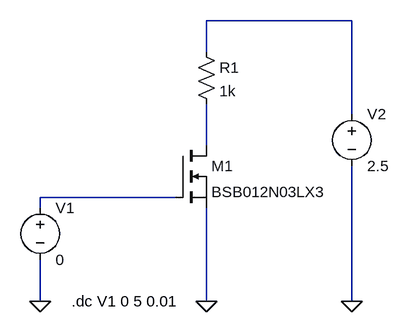
[diagram p0: schematic Draft3.asc]
Draft3.asc, the LTspice schematic file:
Version 4
SHEET 1 880 680
WIRE 496 -144 272 -144
WIRE 272 -96 272 -144
WIRE 496 0 496 -144
WIRE 272 48 272 -16
WIRE 224 128 16 128
WIRE 16 144 16 128
WIRE 16 288 16 224
WIRE 272 288 272 144
WIRE 496 288 496 80
FLAG 16 288 0
FLAG 272 288 0
FLAG 496 288 0
SYMBOL voltage 16 128 R0
SYMATTR InstName V1
SYMATTR Value 0
SYMBOL nmos 224 48 R0
SYMATTR InstName M1
SYMATTR Value BSB012N03LX3
SYMBOL voltage 496 -16 R0
SYMATTR InstName V2
SYMATTR Value 2.5
SYMBOL res 256 -112 R0
SYMATTR InstName R1
SYMATTR Value 1k
TEXT 64 288 Left 2 !.dc V1 0 5 0.01

The netlist it stands for:
* Draft3.asc
V1 N003 0 0
M1 N002 N003 0 0 BSB012N03LX3
V2 N001 0 2.5
R1 N001 N002 1k
.model NMOS NMOS
.model PMOS PMOS
.lib standard.mos
.dc V1 0 5 0.01
.backanno
.end